# EAGLE design AiSWCA_pcb (EAGLE 7.6.0)
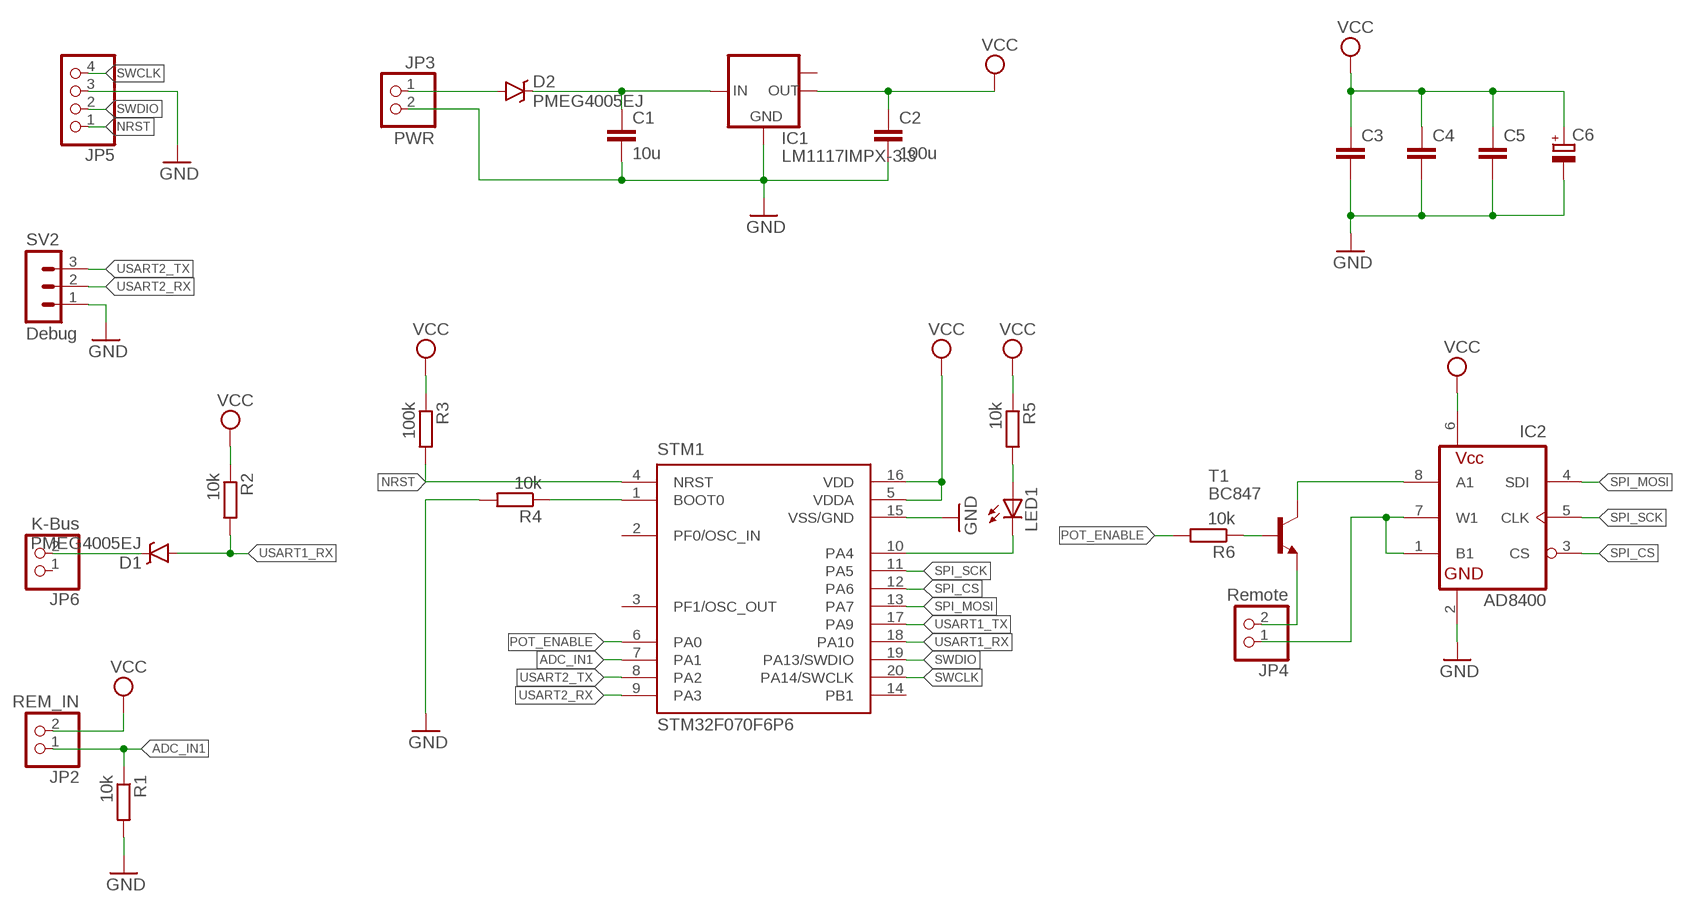
[diagram p0: schematic, sheet 1]

## Parts
C1  10u  C-EUC0805  [C0805]
C2  100u  C-EUC0805  [C0805]
C3  C-EUC0805  [C0805]
C4  C-EUC0805  [C0805]
C5  C-EUC0805  [C0805]
C6  CPOL-EUB/3528-21W  [B/3528-21W]
D1  PMEG4005EJ  DIODE-SCHOTTKY-PMEG4005EJ  [SOD-323]
D2  PMEG4005EJ  DIODE-SCHOTTKY-PMEG4005EJ  [SOD-323]
IC1  LM1117IMPX-3.3  [SOT223]
IC2  AD8400R  [SO8]
JP2  REM_IN  PINHD-1X2/90  [1X02/90]
JP3  PWR  PINHD-1X2/90  [1X02/90]
JP4  Remote  PINHD-1X2/90  [1X02/90]
JP5  PINHD-1X4/90  [1X04/90]
JP6  K-Bus  PINHD-1X2/90  [1X02/90]
LED1  LEDCHIP-LED0805  [CHIP-LED0805]
R1  10k  R-EU_R0805  [R0805]
R2  10k  R-EU_R0805  [R0805]
R3  100k  R-EU_R0805  [R0805]
R4  10k  R-EU_R0805  [R0805]
R5  10k  R-EU_R0805  [R0805]
R6  10k  R-EU_R0805  [R0805]
STM1  STM32F070F6P6  STM32F030F4P6V1  [TSSOP20]
SV2  Debug  MA03-1  [MA03-1]
T1  BC847  [SOT23]

## Nets
ADC_IN1: JP2.1 R1.1 STM1.7(PA1)
GND: C1.2 C2.2 C3.2 C4.2 C5.2 C6.- IC1.1(GND) IC2.2(GND) JP3.2 JP5.3 R1.2 R4.2 STM1.15(VSS/GND) SV2.1
N$1: C1.1 D2.C IC1.3(IN)
N$2: R4.1 STM1.1(BOOT0)
N$3: D1.C JP6.2
N$4: D2.A JP3.1
N$5: LED1.C STM1.10(PA4)
N$6: LED1.A R5.2
N$10: JP4.2 T1.2(E)
N$11: IC2.8(A1) T1.3(C)
N$12: IC2.1(B1) IC2.7(W1) JP4.1
N$14: R6.1 T1.1(B)
NRST: JP5.1 R3.2 STM1.4(NRST)
POT_ENABLE: R6.2 STM1.6(PA0)
SPI_CS: IC2.3(CS) STM1.12(PA6)
SPI_MOSI: IC2.4(SDI) STM1.13(PA7)
SPI_SCK: IC2.5(CLK) STM1.11(PA5)
SWCLK: JP5.4 STM1.20(PA14/SWCLK)
SWDIO: JP5.2 STM1.19(PA13/SWDIO)
USART1_RX: D1.A R2.2 STM1.18(PA10)
USART1_TX: STM1.17(PA9)
USART2_RX: STM1.9(PA3) SV2.2
USART2_TX: STM1.8(PA2) SV2.3
VCC: C2.1 C3.1 C4.1 C5.1 C6.+ IC1.2(OUT) IC2.6(VDD) JP2.2 R2.1 R3.1 R5.1 STM1.5(VDDA) STM1.16(VDD)
Unconnected: IC1.TAB(OUT1) JP6.1 STM1.2(PF0/OSC_IN) STM1.3(PF1/OSC_OUT) STM1.14(PB1)

## Library data of the parts
C1-C5 = rcl:C-EU: CAPACITOR, European symbol
C6 = rcl:CPOL-EU: POLARIZED CAPACITOR, European symbol
D1 D2 = SparkFun-DiscreteSemi:DIODE-SCHOTTKY: Schottky diodes in SFE's production catalog BAT20J 1A 23V 0.62Vf RB751 120mA 40V 0.37Vf PMEG4005EJ 0.5A 40V 0.42Vf MBRA140 1A 40V 0.5Vf B340A 3A 40V SMA; PROD_ID: DIO-10955
IC1 = lm1117:LM1117IMPX-*
IC2 = 00_koarl-div:AD8400: 1-Channel Digital Potentiometer Source: http://www.analog.com/static/imported-files/data_sheets/AD8400_8402_8403.pdf
JP2-JP4 JP6 = pinhead:PINHD-1X2: PIN HEADER
JP5 = pinhead:PINHD-1X4: PIN HEADER
LED1 = led:LED: LED OSRAM: - CHIPLED LG R971, LG N971, LY N971, LG Q971, LY Q971, LO R971, LY R971 LH N974, LH R974 LS Q976, LO Q976, LY Q976 LO Q996 - Hyper CHIPLED LW Q18S LB Q993, LB Q99A, LB R99A - SideLED LS A670, LO A670, LY A670, LG A670, LP A670 LB A673, LV A673, LT A673, LW A673 LH A674 LY A675 LS A676, LA A676, LO A676, LY A676, LW A676 LS A679, LY A679, LG A679 - Hyper Micro SIDELED® LS Y876, LA Y876, LO Y876, LY Y876 LT Y87S - SmartLED LW L88C, LW L88S LB L89C, LB L89S, LG L890 LS L89K, LO L89K, LY L89K LS L896, LA L896, LO L896, LY L896 - TOPLED LS T670, LO T670, LY T670, LG T670, LP T670 LSG T670, LSP T670, LSY T670, LOP T670, LYG T670 LG T671, LOG T671, LSG T671 LB T673, LV T673, LT T673, LW T673 LH T674 LS T676, LA T676, LO T676, LY T676, LB T676, LH T676, LSB T676, LW T676 LB T67C, LV T67C, LT T67C, LS T67K, LO T67K, LY T67K, LW E67C LS E67B, LA E67B, LO E67B, LY E67B, LB E67C, LV E67C, LT E67C LW T67C LS T679, LY T679, LG T679 LS T770, LO T770, LY T770, LG T770, LP T770 LB T773, LV T773, LT T773, LW T773 LH T774 LS E675, LA E675, LY E675, LS T675 LS T776, LA T776, LO T776, LY T776, LB T776 LHGB T686 LT T68C, LB T68C - Hyper Mini TOPLED® LB M676 - Mini TOPLED Santana® LG M470 LS M47K, LO M47K, LY M47K Source: http://www.osram.convergy.de LUXEON: - LUMILED® LXK2-PW12-R00, LXK2-PW12-S00, LXK2-PW14-U00, LXK2-PW14-V00 LXK2-PM12-R00, LXK2-PM12-S00, LXK2-PM14-U00 LXK2-PE12-Q00, LXK2-PE12-R00, LXK2-PE12-S00, LXK2-PE14-T00, LXK2-PE14-U00 LXK2-PB12-K00, LXK2-PB12-L00, LXK2-PB12-M00, LXK2-PB14-N00, LXK2-PB14-P00, LXK2-PB14-Q00 LXK2-PR12-L00, LXK2-PR12-M00, LXK2-PR14-Q00, LXK2-PR14-R00 LXK2-PD12-Q00, LXK2-PD12-R00, LXK2-PD12-S00 LXK2-PH12-R00, LXK2-PH12-S00 LXK2-PL12-P00, LXK2-PL12-Q00, LXK2-PL12-R00 Source: www.luxeon.com KINGBRIGHT: KA-3528ASYC Source: www.kingbright.com
R1-R6 = rcl:R-EU_: RESISTOR, European symbol
STM1 = stm32f030f4:STM32F030F4P6
SV2 = con-lstb:MA03-1: PIN HEADER; OC_FARNELL: unknown; OC_NEWARK: unknown
T1 = transistor:BC847: NPN TRANSISTOR

## Board
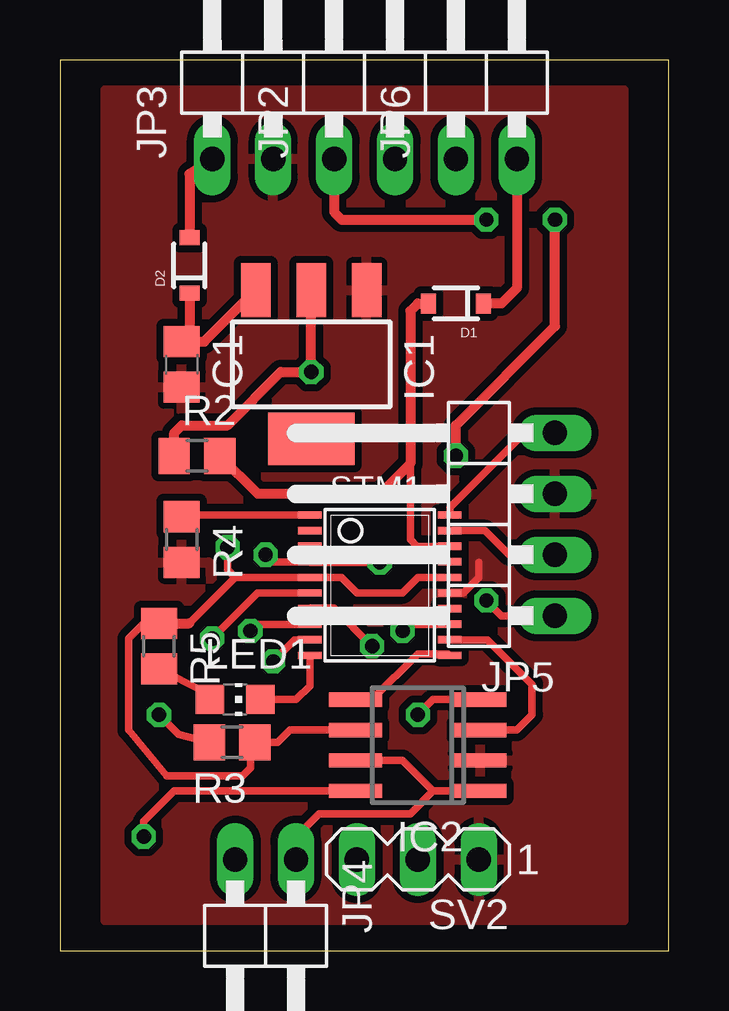
[diagram p1: board, top side]
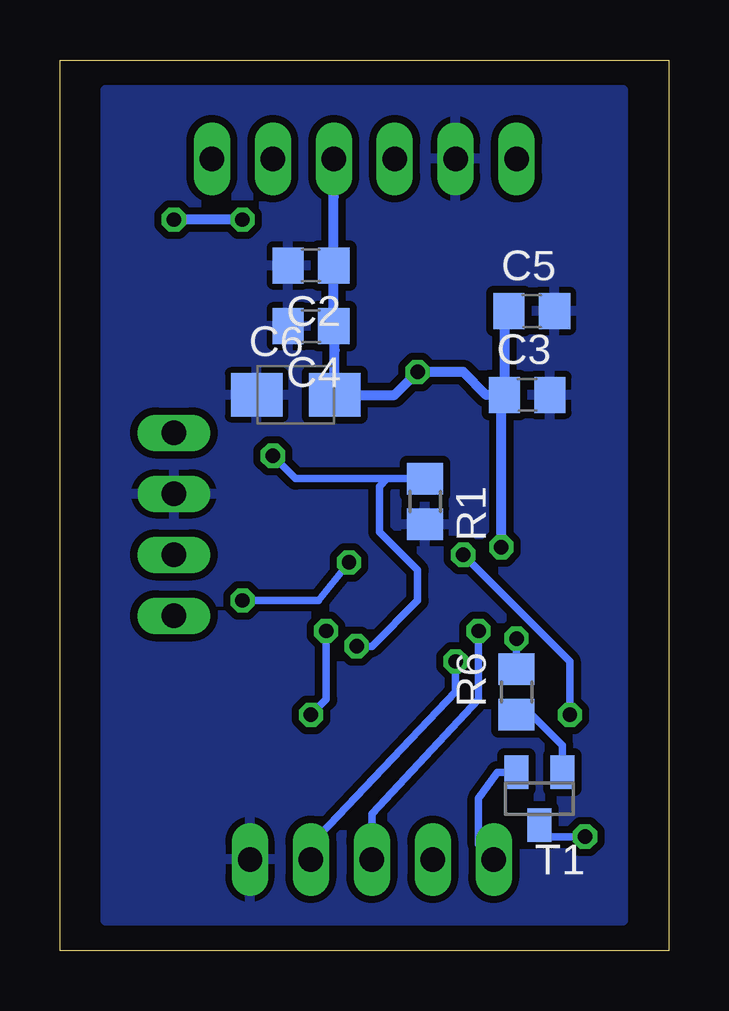
[diagram p2: board, bottom side, seen from below]

Size 25.39 x 37.14 mm. Coordinates in mm from the lower left corner, seen from the top.
Outline: 0,0 25.39,0 25.39,37.14 0,37.14 0,0
Copper layers (1*16): Top 0.035mm / dielectric 1.5mm / Bottom 0.035mm
Design rules "default *": minimum track width 10mil, minimum drill 24mil, track to track 8mil, track to pad 8mil, pad to pad 8mil, via to via 8mil, smd to smd 8mil, copper to edge 40mil, drill to drill 8mil, minimum pad ring 10mil, minimum via ring 8mil, stop-mask expansion 4mil, vias tented up to drill 0.6mm, thermal gap 10mil

### Footprints (pad centres in the part's own frame; a part is rotated, then mirrored left to right if it is on the bottom)
C0805 = smd 1.3 x 1.5: 1 -0.95,0; 2 0.95,0
B/3528-21W = smd 2.15 x 1.8: + 1.625,0; - -1.625,0
SOD-323 = smd 0.63 x 0.83: A 1.15,0; C -1.15,0
SOT223 = smd 1.219 x 2.235: 1 -2.311,-3.099; 2 0,-3.099; 3 2.311,-3.099 | smd 3.6 x 2.2: TAB 0,3.099
SO8 = smd 0.6 x 2.2: 1 -1.905,-2.6; 2 -0.635,-2.6; 3 0.635,-2.6; 4 1.905,-2.6; 5 1.905,2.6; 6 0.635,2.6; 7 -0.635,2.6; 8 -1.905,2.6
1X02/90 = drill 1.016 long: 1 -1.27,-3.81; 2 1.27,-3.81
1X04/90 = drill 1.016 long: 1 -3.81,-3.81; 2 -1.27,-3.81; 3 1.27,-3.81; 4 3.81,-3.81
CHIP-LED0805 = smd 1.2 x 1.2: A 0,-1.05; C 0,1.05
R0805 = smd 1.3 x 1.5: 1 -0.95,0; 2 0.95,0
TSSOP20 = smd 0.305 x 0.991: 1 -2.925,-2.918; 2 -2.275,-2.918; 3 -1.625,-2.918; 4 -0.975,-2.918; 5 -0.325,-2.918; 6 0.325,-2.918; 7 0.975,-2.918; 8 1.625,-2.918; 9 2.275,-2.918; 10 2.925,-2.918; 11 2.925,2.918; 12 2.275,2.918; 13 1.625,2.918; 14 0.975,2.918; 15 0.325,2.918; 16 -0.325,2.918; 17 -0.975,2.918; 18 -1.625,2.918; 19 -2.275,2.918; 20 -2.925,2.918
MA03-1 = drill 1.016 long: 1 -2.54,0; 2 0,0; 3 2.54,0
SOT23 = smd 1 x 1.4: 1 -0.95,-1.1; 2 0.95,-1.1; 3 0,1.1

### Placement (x,y rotation side)
C1  5.08,24.45 270 top
C2  14.92,28.57 180 bottom
C3  5.91,23.18 0 bottom
C4  14.92,26.04 180 bottom
C5  5.71,26.67 0 bottom
C6  15.56,23.18 0 bottom
D1  16.51,26.99 180 top
D2  5.4,28.57 90 top
IC1  10.48,24.45 180 top
IC2  14.92,8.57 90 top
JP2  12.7,36.83 0 top
JP3  7.62,36.83 0 top
JP4  8.57,0 180 top
JP5  16.83,17.78 90 top
JP6  17.78,36.83 0 top
LED1  7.3,10.48 270 top
R1  10.16,18.73 270 bottom
R2  5.71,20.64 0 top
R3  7.18,8.7 180 top
R4  5.08,17.14 270 top
R5  4.13,12.7 270 top
R6  6.35,10.79 90 bottom
STM1  13.34,15.24 270 top
SV2  14.92,3.81 180 top
T1  5.4,6.35 180 bottom

### Tracks (layer width: path | path; a pad name or v marks a point on that pad's centre or on a via)
ADC_IN1  (via drill 0.6)
  Top 0.305: STM1.7 10.44,14.29 11.43,14.29 v13.02,12.7
  Top 0.406: v16.51,20.64 16.51,21.91 20.64,26.04 v20.64,30.48 | JP2.1 11.43,30.8 11.75,30.48 v17.78,30.48
  Bottom 0.305: R1.1 11.75,19.68 | 11.75,19.68 15.56,19.68 v16.51,20.64 | 11.75,19.68 12.06,19.36 12.06,17.46 10.48,15.88 10.48,14.61 12.38,12.7 v13.02,12.7
  Bottom 0.406: v17.78,30.48 v20.64,30.48
GND
  Top 0.305: STM1.15 16.26,14.92 16.83,14.92 17.46,15.56 17.46,16.19
  pour Top (isolate 0.305): 1.91,35.88 23.49,35.88 23.49,1.27 1.91,1.27
  pour Bottom (isolate 0.305): 1.91,35.88 23.49,35.88 23.49,1.27 1.91,1.27
N$1
  Top 0.305: C1.1 5.4,25.4
  Top 0.406: D2.C 5.4,25.71 C1.1 6.02,25.4 IC1.3
N$2
  Top 0.305: STM1.1 5.15,18.16 arc90 R4.1
N$3
  Top 0.406: JP6.2 19.05,27.62 18.41,26.99 D1.C
N$4
  Top 0.406: JP3.1 5.4,32.39 D2.A
N$5
  Top 0.305: LED1.C 9.84,10.48 10.42,11.05 STM1.10
N$6
  Top 0.305: R5.2 6.04,10.79 LED1.A
N$10
  Bottom 0.305: JP4.2 7.94,4.45 7.94,6.35 7.16,7.45 T1.2
N$11  (via drill 0.6)
  Top 0.305: IC2.8 4.76,6.67 3.49,5.4 v3.49,4.76
  Bottom 0.305: T1.3 4.91,4.76 v3.49,4.76
N$12
  Top 0.305: 15.56,6.67 14.61,5.71 10.79,5.71 9.84,4.76 JP4.1 | 15.56,6.67 IC2.1 | IC2.7 14.29,7.94 15.56,6.67
N$14
  Bottom 0.305: T1.1 4.45,8.57 5.72,9.84 R6.1
NRST  (via drill 0.6)
  Top 0.305: v8.57,16.51 8.87,16.21 STM1.4 10.44,16.19 v13.34,16.19 | v4.13,9.84 4.95,9.02 R3.2 | v17.78,14.61 18.41,13.97 JP5.1
  Bottom 0.305: v8.57,16.51 4.13,12.07 v4.13,9.84 | v13.34,16.19 14.61,14.61 v17.78,14.61
POT_ENABLE  (via drill 0.6)
  Top 0.305: v6.35,13.02 8.25,14.91 STM1.6
  Bottom 0.305: R6.2 v6.35,13.02
SPI_CS
  Top 0.305: IC2.3 19.05,9.21 19.68,9.84 19.68,11.11 17.83,12.96 STM1.12
SPI_MOSI  (via drill 0.6)
  Top 0.305: IC2.4 15.56,10.48 v14.92,9.84 | v14.29,13.34 14.57,13.61 STM1.13
  Bottom 0.305: v14.92,9.84 14.29,10.48 v14.29,13.34
SPI_SCK
  Top 0.305: 15.81,12.32 STM1.11 16.18,12.38 14.92,12.38 13.02,10.48 IC2.5
SWCLK
  Top 0.305: JP5.4 19.37,21.59 16.25,18.48 STM1.20
SWDIO
  Top 0.305: JP5.2 18.73,16.51 17.73,17.52 STM1.19
USART1_RX
  Top 0.305: STM1.18 14.88,16.86 14.61,17.14 14.61,20.32
  Top 0.406: D1.A 14.92,26.99 14.61,26.67 14.61,20.32 13.34,19.05 8.25,19.05 R2.2
USART2_RX  (via drill 0.6)
  Top 0.305: v8.89,12.07 9.79,12.96 STM1.9
  Bottom 0.305: v8.89,12.07 8.89,10.79 14.92,4.45 SV2.2
USART2_TX  (via drill 0.6)
  Top 0.305: STM1.8 8.22,13.61 v7.94,13.34
  Bottom 0.305: v7.94,13.34 7.94,10.48 12.38,5.71 SV2.3
VCC  (via drill 0.6)
  Top 0.305: R5.1 4.76,13.65 | STM1.16 14.93,15.57 14.29,14.92 12.38,14.92 11.75,15.56 STM1.5 7.31,15.57 | 5.4,13.65 7.31,15.57 | v6.99,16.83 6.99,15.89 7.31,15.57 | IC2.6 9.59,9.21 9.08,8.7 R3.1 7.94,8.51 7.94,7.62 7.62,7.3 4.45,7.3 2.86,9.21 2.86,13.02 3.49,13.65 R5.1 | 4.44,13.65 R5.1
  Top 0.406: R5.1 5.4,13.65 | IC1.2 v10.48,24.13 9.21,24.13 6.99,21.91 5.08,21.91 4.76,21.59 4.77,21.59 R2.1
  Bottom 0.305: C5.1 6.86,26.48
  Bottom 0.406: 6.86,26.48 C3.1 | C3.1 7.62,23.18 8.57,24.13 v10.48,24.13 11.43,23.18 C6.+ 13.93,25.04 C4.1 C2.1 13.97,31.43 JP2.2 | v6.99,16.83 6.99,23.05 C3.1